# Altium schematic sheet Ethernet.SchDoc
size A4; PageSetup: Record=PageOptions|CenterHorizontal=False|CenterVertical=False|PrintScale=0.95|XCorrection=0.00|YCorrection=0.00|PrintKind=1|BorderSize=5000000|LeftOffset=0|BottomOffset=0|Orientation=1|PaperLength=1000|PaperWidth=1000|Scale=100|PaperSource=15|PrintQuality=600|MediaType=1|DitherType=10|PaperKind=A4|PrintScaleMode=1; Organization: My Company; Address1: Address Line 1; Address2: Address Line 2; Address3: Address Line 3; Address4: Address Line 4; SheetNumber: 1; SheetTotal: 7
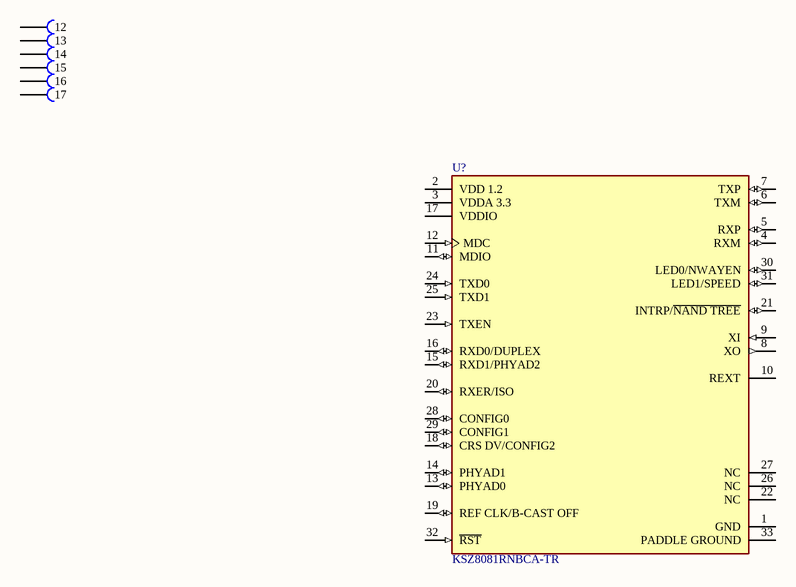
[diagram p0: Ethernet.SchDoc]

## Parts
(Parts that share a designator on the sheet are numbered #1, #2 ... from top to bottom, then left to right.)
i.MX?#1  i.MX6_SoM  [i.MX6_SoM]  (value not drawn)  (part L of 159)  (no BOM)
i.MX?#2  i.MX6_SoM  [i.MX6_SoM]  (value not drawn)  (part M of 159)  (no BOM)
i.MX?#3  i.MX6_SoM  [i.MX6_SoM]  (value not drawn)  (part N of 159)  (no BOM)
i.MX?#4  i.MX6_SoM  [i.MX6_SoM]  (value not drawn)  (part O of 159)  (no BOM)
i.MX?#5  i.MX6_SoM  [i.MX6_SoM]  (value not drawn)  (part P of 159)  (no BOM)
i.MX?#6  i.MX6_SoM  [i.MX6_SoM]  (value not drawn)  (part Q of 159)  (no BOM)
U?  KSZ8081RNBCA-TR  [FP-QFN55-32LD-PL-5-MFG]

## Nets

Not connected (* = marked no-connect by the designer): i.MX?#1 12; i.MX?#2 13; i.MX?#3 14; i.MX?#4 15; i.MX?#5 16; i.MX?#6 17; U? 1(GND) 2(VDD_1.2) 3(VDDA_3.3) 4(RXM) 5(RXP) 6(TXM) 7(TXP) 8(XO) 9(XI) 10(REXT) 11(MDIO) 12(MDC) 13(PHYAD0) 14(PHYAD1) 15(RXD1/PHYAD2) 16(RXD0/DUPLEX) 17(VDDIO) 18(CRS_DV/CONFIG2) 19(REF_CLK/B-CAST_OFF) 20(RXER/ISO) 21(INTRP/~{NAND_TREE}) 22(NC) 23(TXEN) 24(TXD0) 25(TXD1) 26(NC) 27(NC) 28(CONFIG0) 29(CONFIG1) 30(LED0/NWAYEN) 31(LED1/SPEED) 32(~{RST}) 33(PADDLE_GROUND)

## Notes on the sheet
- Title:
- Author:
- Approved:
- Size:
- Date:
- Git Hash:
- A4
- Prj:
- SW Version:
- Variant:
- Edited:
- CONFIDENTIAL
- File:

## Library data of the parts
U? = CMP-06281-000011-1: IC TRANSCEIVER FULL 1/1 32QFN; Manufacturer: Microchip; Standoff Height: 0mm; Simplex Duplex: Full Duplex; Number Of Channels: 1; Data Rate: 100Mbits/s; Max Supply Voltage: 3.465V; Min Supply Voltage: 1.71V; Nominal Supply Current: 20-47mA; Interface: Ethernet,Other; Max Junction Temp: +125°C; Device Class L2: Interface ICs; Category: IC; Temperature: to +125°C; RoHS: TRUE; Mouser Description: Ethernet ICs 10/100 PHY,  0.11u; Package: QFN55-32LD-PL-5; ComponentLink2URL: http://ww1.microchip.com/downloads/en/DeviceDoc/00002202C.pdf; Digikey Description: IC TRANSCEIVER FULL 1/1 32QFN; Height: 1mm; Lead Free: Yes; Temperature Range High: +125°C; Octopart: https://octopart.com/ksz8081rnbca-tr-microchip-66799962; Device Class L1: Integrated Circuits (ICs); Ambient Temperature Range Low: 0°C; Automotive: No; ComponentLink2Description: Datasheet; Ambient Temperature Range High: +70°C; Device Class L3: Ethernet Interface ICs; Manufacturer Part Number: KSZ8081RNBCA-TR